# EAGLE design buckler (EAGLE 9.6.2)
AUTHOR: Branden Ghena; REV: C; TITLE: Berkeley Buckler

## Sheet 1 of 3: Headers
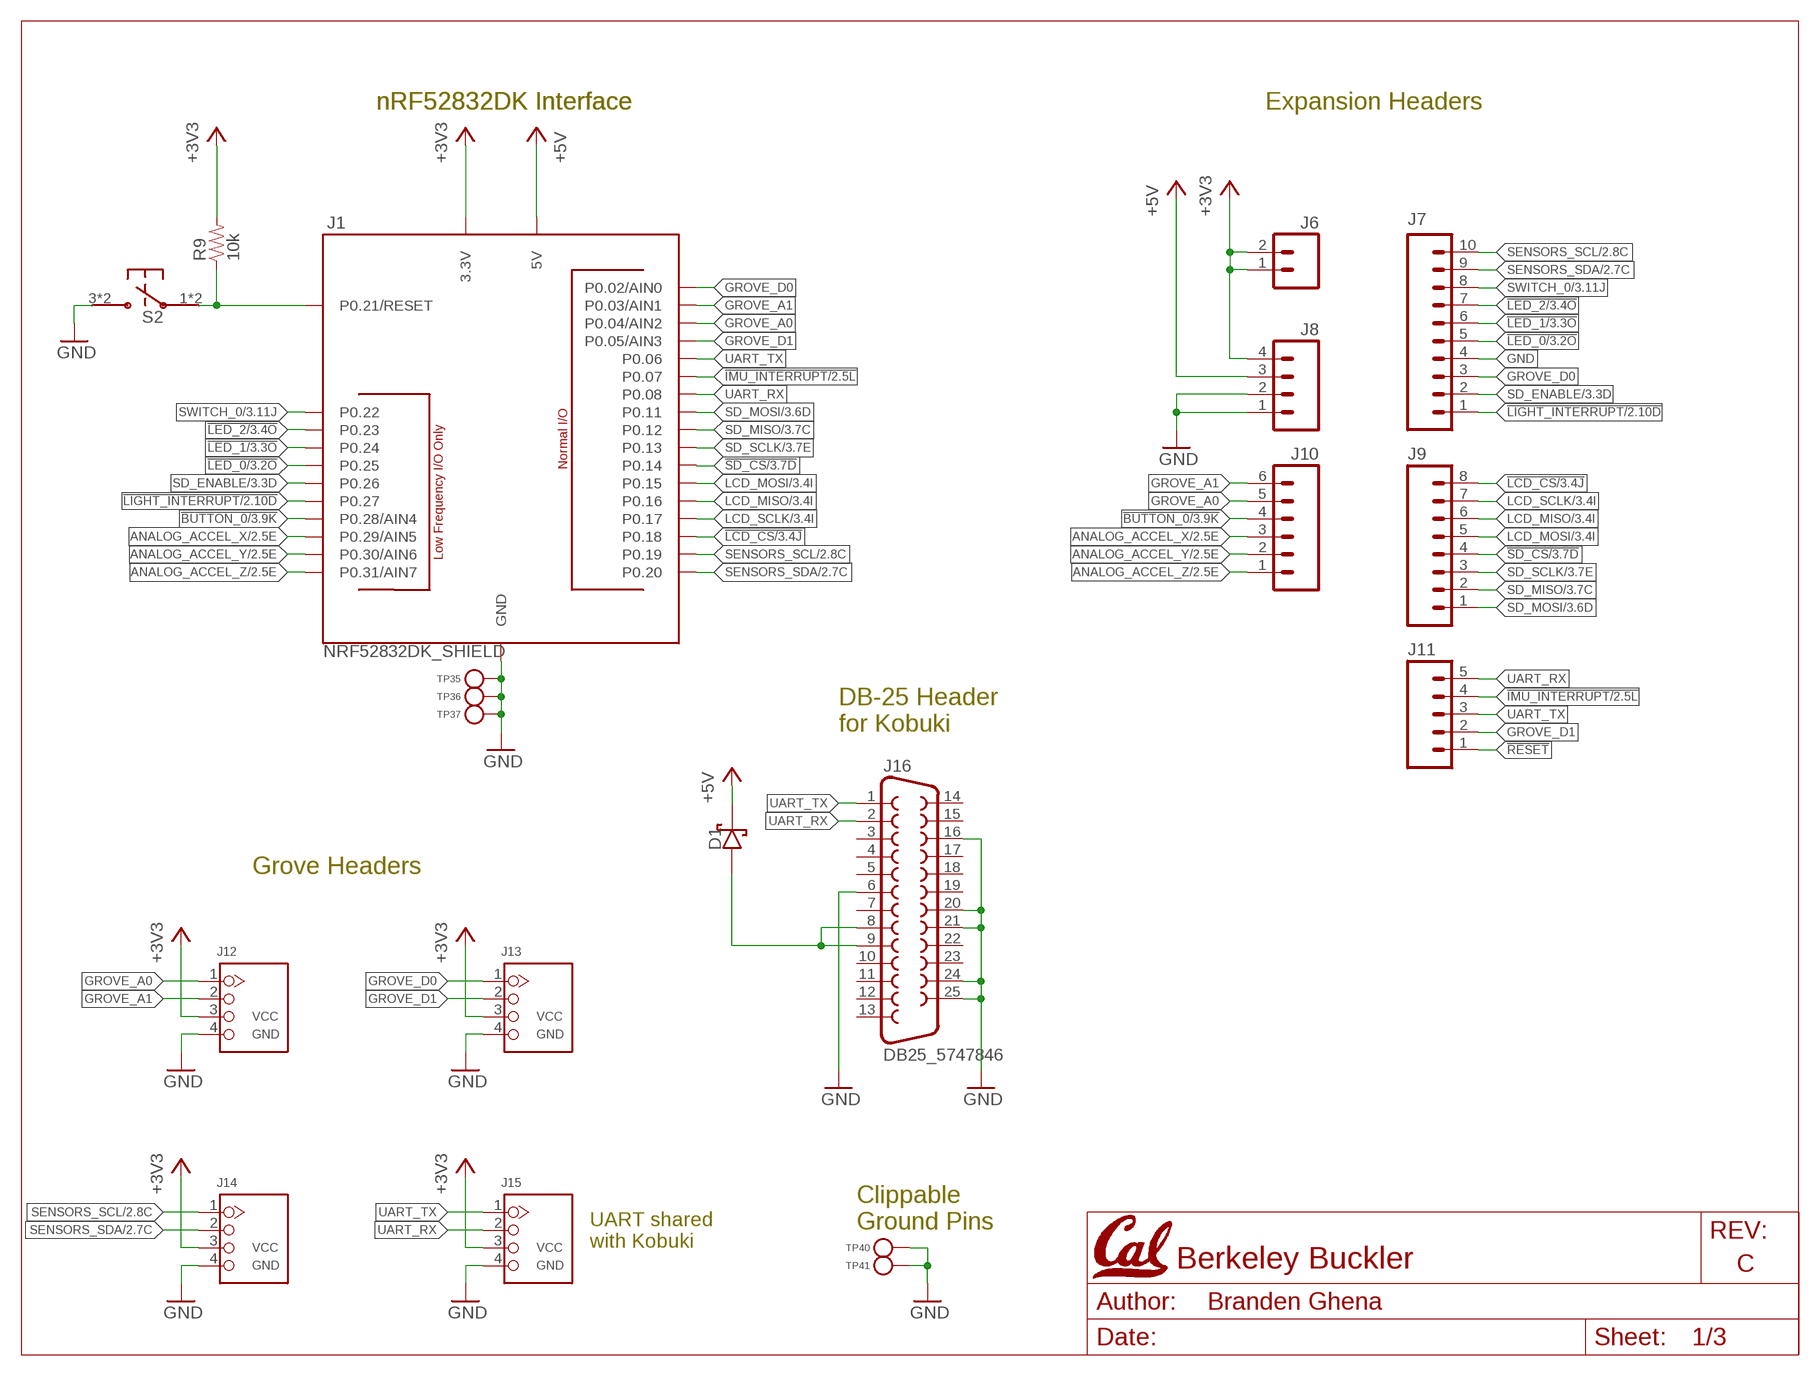
[diagram p0: schematic, sheet 1]
U$1 (LETTER_L_CAL): HEIGHT: 8.5in; WIDTH: 11in

### Parts
D1  DIODE_SCHOTTKYSOD323  [SOD323]
J1  NRF52832DK_SHIELD  [NRF52832DK_SHIELD]
J6  M02PTH  [1X02]
J7  M10"  [1X10]
J8  M04PTH  [1X04]
J9  M081X08  [1X08]
J10  M06SIP  [1X06]
J11  M05PTH  [1X05]
J12  GROVE-CONNECTOR-DIP(4P-2.0)  [HW4-2.0]
J13  GROVE-CONNECTOR-DIP(4P-2.0)  [HW4-2.0]
J14  GROVE-CONNECTOR-DIP(4P-2.0)  [HW4-2.0]
J15  GROVE-CONNECTOR-DIP(4P-2.0)  [HW4-2.0]
J16  DB25_5747846  [DB25_5747846]
R9  10k  RESISTOR0402_RES  [0402_RES]
S2  PTS645SM43SMTR92  [PTS645]
TP35  TEST_POINT_0.040IN  [TESTPOINT_0.040IN]
TP36  TEST_POINT_0.040IN  [TESTPOINT_0.040IN]
TP37  TEST_POINT_0.040IN  [TESTPOINT_0.040IN]
TP40  TEST_POINT_0.078IN  [TESTPOINT_0.078IN]
TP41  TEST_POINT_0.078IN  [TESTPOINT_0.078IN]

### Nets
5V_IN: D1.P$2(ANODE) J16.8 J16.9
!BUTTON_0: J1.P0.28(P0.28/AIN4) J10.4 ; also sheet 3
!IMU_INTERRUPT: J1.P0.07 J11.4 ; also sheet 2
!LCD_CS: J1.P0.18 J9.8 ; also sheet 3
!LED_0: J1.P0.25 J7.5 ; also sheet 3
!LED_1: J1.P0.24 J7.6 ; also sheet 3
!LED_2: J1.P0.23 J7.7 ; also sheet 3
!LIGHT_INTERRUPT: J1.P0.27 J7.1 ; also sheet 2
!RESET: J1.P0.21(P0.21/RESET) J11.1 R9.1 S2.1 S2.2
!SD_CS: J1.P0.14 J9.4 ; also sheet 3
+3V3: J1.3.3V@0(3.3V) J1.3.3V@1(3.3V) J1.3.3V@2(3.3V) J6.1 J6.2 J8.4 J12.3 J13.3 J14.3 J15.3 R9.2 ; also sheet 2,3
+5V: D1.P$1(CATHODE) J1.5V J8.3
ANALOG_ACCEL_X: J1.P0.29(P0.29/AIN5) J10.3 ; also sheet 2
ANALOG_ACCEL_Y: J1.P0.30(P0.30/AIN6) J10.2 ; also sheet 2
ANALOG_ACCEL_Z: J1.P0.31(P0.31/AIN7) J10.1 ; also sheet 2
GND: J1.GND@0(GND) J1.GND@1(GND) J1.GND@2(GND) J7.4 J8.1 J8.2 J12.4 J13.4 J14.4 J15.4 J16.6 J16.16 J16.20 J16.21 J16.24 J16.25 S2.3 S2.4 TP35.TESTPOINT TP36.TESTPOINT TP37.TESTPOINT TP40.1(TESTPOINT) TP41.1(TESTPOINT) ; also sheet 2,3
GROVE_A0: J1.P0.04(P0.04/AIN2) J10.5 J12.1
GROVE_A1: J1.P0.03(P0.03/AIN1) J10.6 J12.2
GROVE_D0: J1.P0.02(P0.02/AIN0) J7.3 J13.1
GROVE_D1: J1.P0.05(P0.05/AIN3) J11.2 J13.2
LCD_MISO: J1.P0.16 J9.6 ; also sheet 3
LCD_MOSI: J1.P0.15 J9.5 ; also sheet 3
LCD_SCLK: J1.P0.17 J9.7 ; also sheet 3
SD_ENABLE: J1.P0.26 J7.2 ; also sheet 3
SD_MISO: J1.P0.12 J9.2 ; also sheet 3
SD_MOSI: J1.P0.11 J9.1 ; also sheet 3
SD_SCLK: J1.P0.13 J9.3 ; also sheet 3
SENSORS_SCL: J1.P0.19 J7.10 J14.1 ; also sheet 2
SENSORS_SDA: J1.P0.20 J7.9 J14.2 ; also sheet 2
SWITCH_0: J1.P0.22 J7.8 ; also sheet 3
UART_RX: J1.P0.08 J11.5 J15.2 J16.2
UART_TX: J1.P0.06 J11.3 J15.1 J16.1
Unconnected: J16.3 J16.4 J16.5 J16.7 J16.10 J16.11 J16.12 J16.13 J16.14 J16.15 J16.17 J16.18 J16.19 J16.22 J16.23

### Notes on the sheet
- nRF52832DK Interface | nRF52832DK Interface | Expansion Headers
- DB-25 Header
  for Kobuki
- Grove Headers
- Clippable
  Ground Pins
- UART shared
  with Kobuki

## Sheet 2 of 3: Sensors
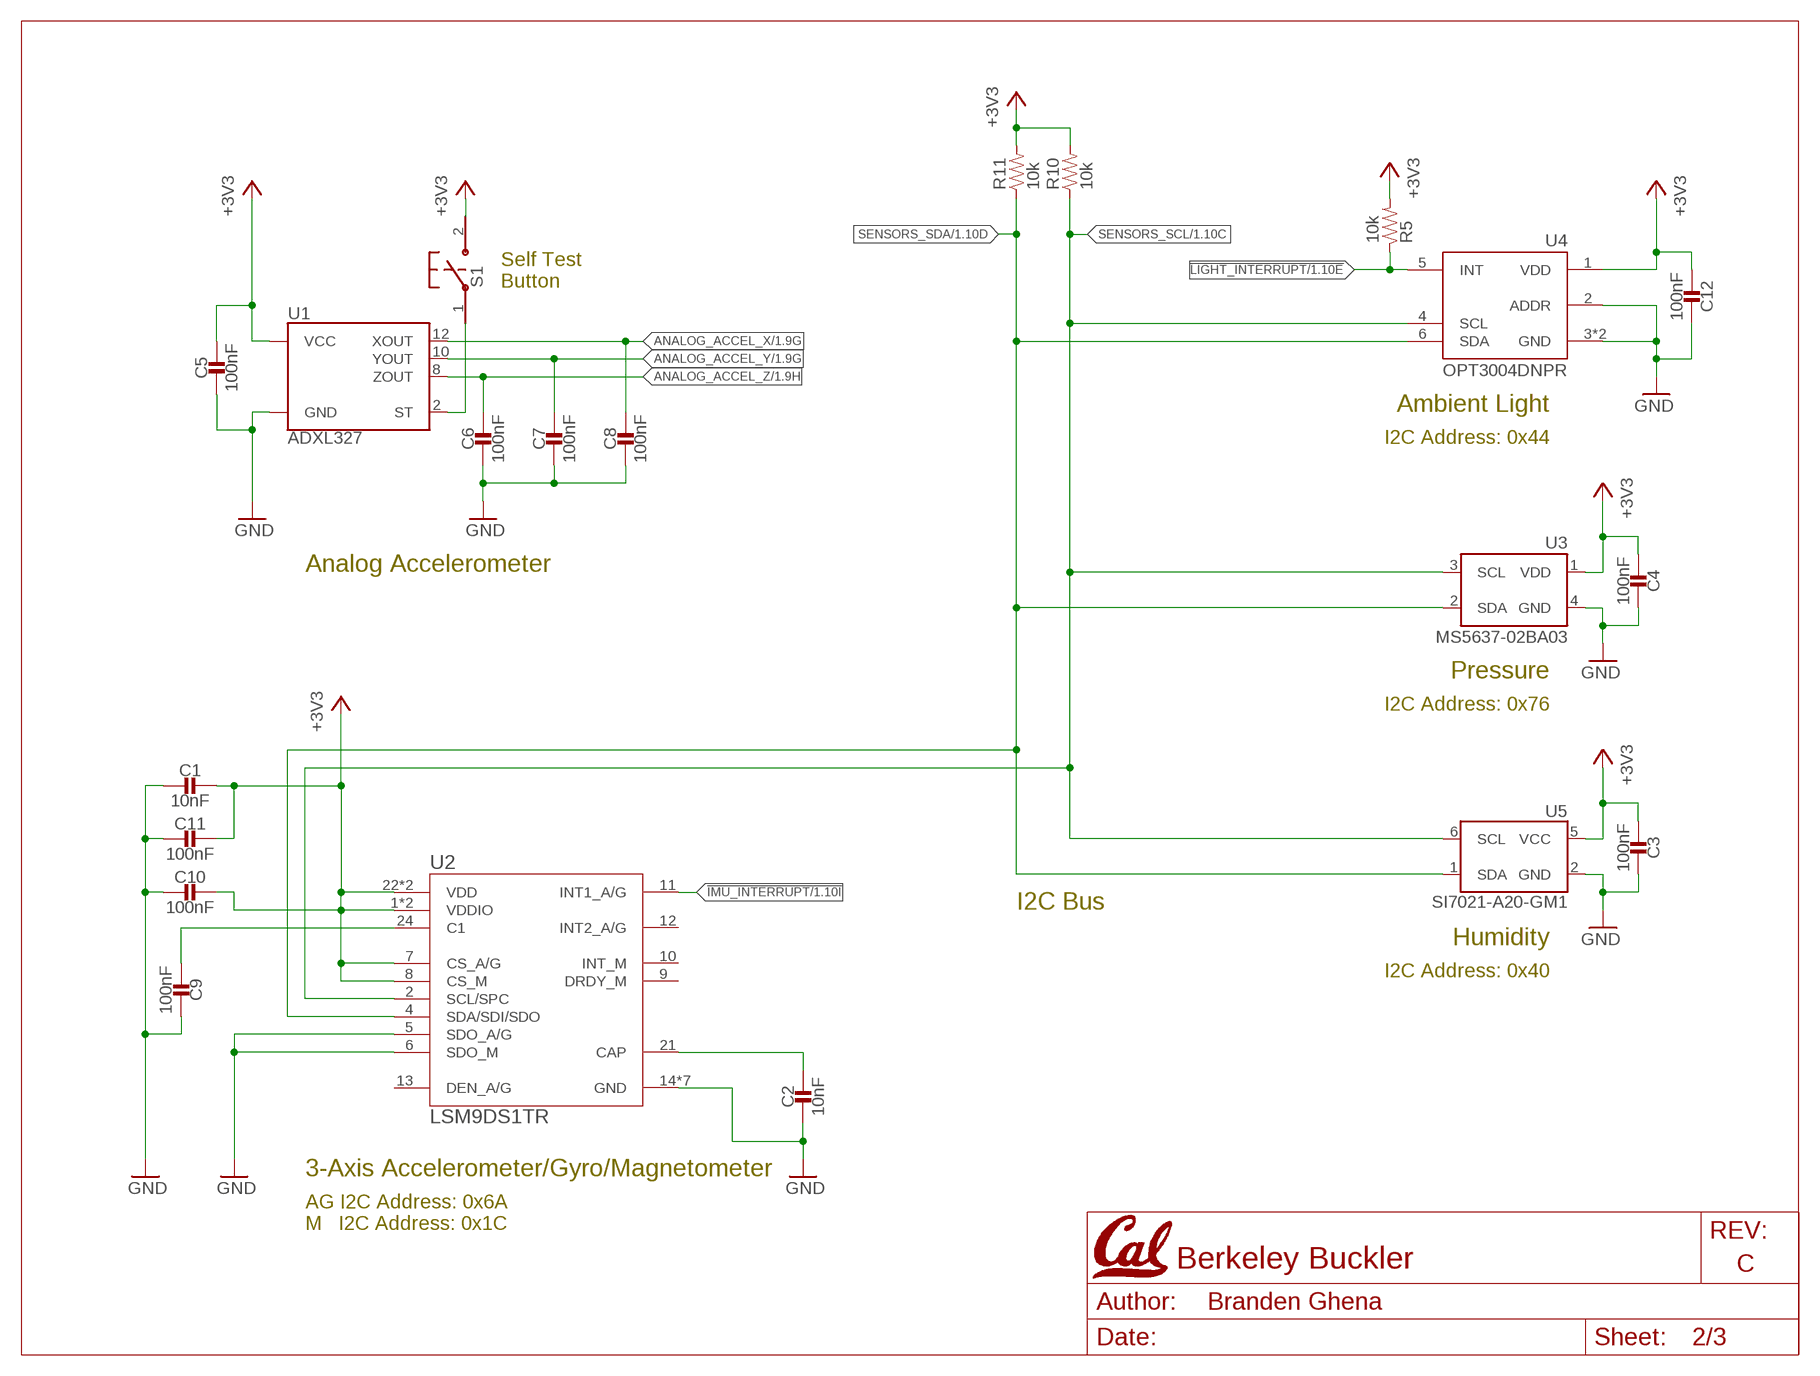
[diagram p1: schematic, sheet 2]
U$2 (LETTER_L_CAL): HEIGHT: 8.5in; WIDTH: 11in

### Parts
C1  10nF  CAPACITOR0402_CAP  [0402_CAP]
C2  10nF  CAPACITOR0402_CAP  [0402_CAP]
C3  100nF  CAPACITOR0402_CAP  [0402_CAP]
C4  100nF  CAPACITOR0402_CAP  [0402_CAP]
C5  100nF  CAPACITOR0402_CAP  [0402_CAP]
C6  100nF  CAPACITOR0402_CAP  [0402_CAP]
C7  100nF  CAPACITOR0402_CAP  [0402_CAP]
C8  100nF  CAPACITOR0402_CAP  [0402_CAP]
C9  100nF  CAPACITOR0402_CAP  [0402_CAP]
C10  100nF  CAPACITOR0402_CAP  [0402_CAP]
C11  100nF  CAPACITOR0402_CAP  [0402_CAP]
C12  100nF  CAPACITOR0402_CAP  [0402_CAP]
R5  10k  RESISTOR0402_RES  [0402_RES]
R10  10k  RESISTOR0402_RES  [0402_RES]
R11  10k  RESISTOR0402_RES  [0402_RES]
S1  B3U-1000P  [B3U-1000P]
U1  ADXL327  [LFCSP-16]
U2  LSM9DS1TR  [LGA-24_3X3P5X1_STM]
U3  MS5637-02BA03  [4-SMD]
U4  OPT3004DNPR  [DNP0006A]
U5  SI7021-A20-GM1  [DFN-6/3MM]

### Nets
!IMU_INTERRUPT: U2.11(INT1_A/G) ; also sheet 1
!LIGHT_INTERRUPT: R5.1 U4.5(INT) ; also sheet 1
+3V3: C1.2 C3.1 C4.1 C5.1 C10.2 C11.2 C12.1 R5.2 R10.2 R11.2 S1.2 U1.14(VCC) U1.15(VCC) U2.1(VDDIO) U2.3(VDDIO) U2.7(CS_A/G) U2.8(CS_M) U2.22(VDD) U2.23(VDD) U3.1(VDD) U4.1(VDD) U5.5(VCC) ; also sheet 1,3
ANALOG_ACCEL_X: C8.1 U1.12(XOUT) ; also sheet 1
ANALOG_ACCEL_Y: C7.1 U1.10(YOUT) ; also sheet 1
ANALOG_ACCEL_Z: C6.1 U1.8(ZOUT) ; also sheet 1
GND: C1.1 C2.1 C3.2 C4.2 C5.2 C6.2 C7.2 C8.2 C9.2 C10.1 C11.1 C12.2 U1.3(GND) U1.5(GND) U1.6(GND) U1.7(GND) U2.5(SDO_A/G) U2.6(SDO_M) U2.14(GND) U2.15(GND) U2.16(GND) U2.17(GND) U2.18(GND) U2.19(GND) U2.20(GND) U3.4(GND) U4.2(ADDR) U4.3(GND) U4.7(GND) U5.2(GND) ; also sheet 1,3
N$1: C9.1 U2.24(C1)
N$6: C2.2 U2.21(CAP)
N$7: S1.1 U1.2(ST)
SENSORS_SCL: R10.1 U2.2(SCL/SPC) U3.3(SCL) U4.4(SCL) U5.6(SCL) ; also sheet 1
SENSORS_SDA: R11.1 U2.4(SDA/SDI/SDO) U3.2(SDA) U4.6(SDA) U5.1(SDA) ; also sheet 1
Unconnected: U2.9(DRDY_M) U2.10(INT_M) U2.12(INT2_A/G) U2.13(DEN_A/G)

### Notes on the sheet
- Self Test
  Button
- Ambient Light
- I2C Address: 0x44
- Analog Accelerometer
- Pressure
- I2C Address: 0x76
- I2C Bus
- Humidity
- I2C Address: 0x40
- 3-Axis Accelerometer/Gyro/Magnetometer
- AG I2C Address: 0x6A
  M   I2C Address: 0x1C

## Sheet 3 of 3: Other Peripherals
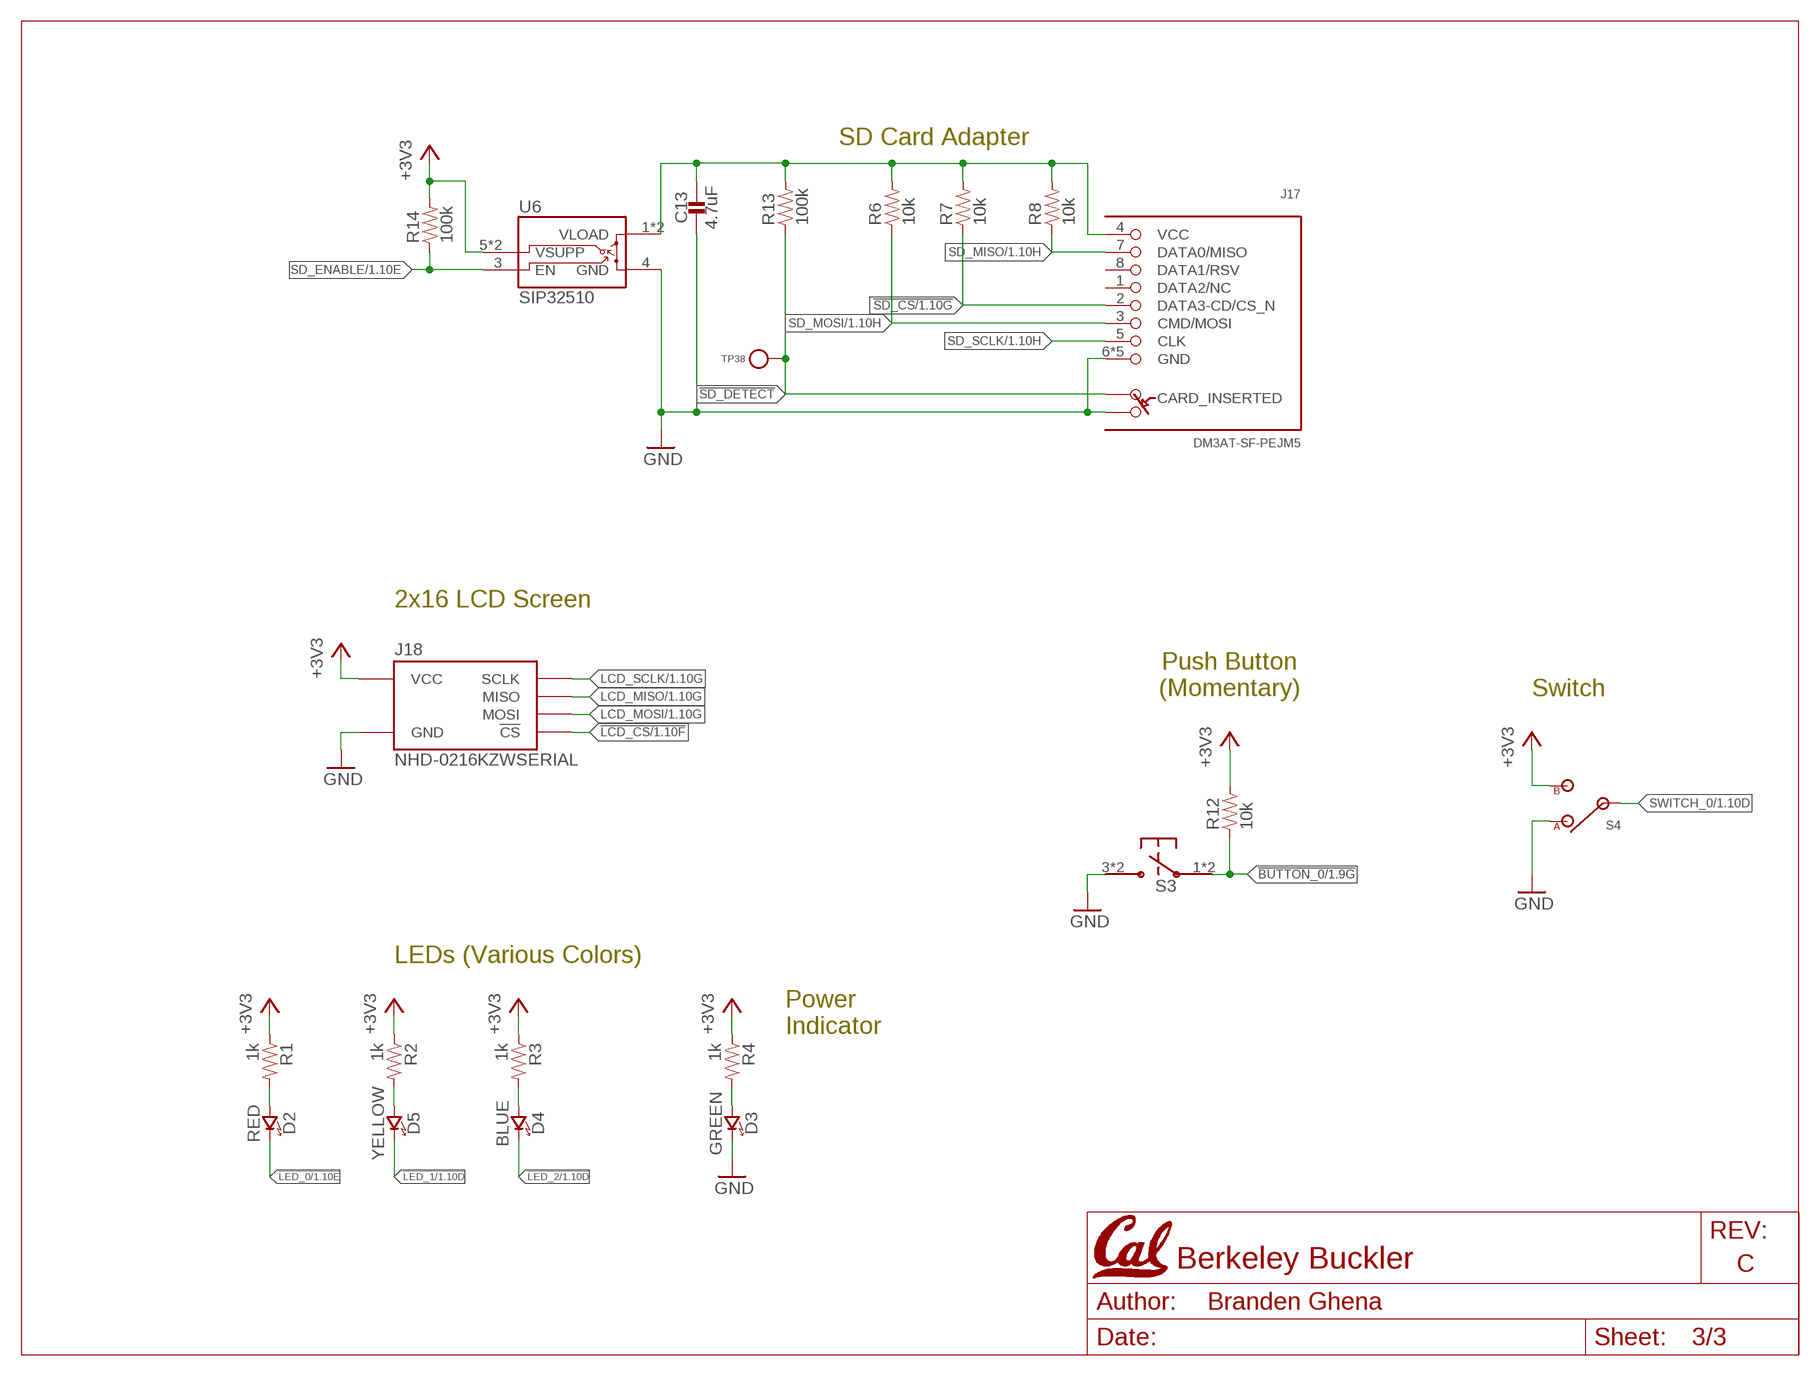
[diagram p2: schematic, sheet 3]
U$3 (LETTER_L_CAL): HEIGHT: 8.5in; WIDTH: 11in

### Parts
C13  4.7uF  CAPACITOR0402_CAP  [0402_CAP]
D2  RED  LED0603  [LED-0603]
D3  GREEN  LED0603  [LED-0603]
D4  BLUE  LED0603  [LED-0603]
D5  YELLOW  LED0603  [LED-0603]
J17  DM3AT-SF-PEJM5  [DM3AT-SF-PEJM5]
J18  NHD-0216KZWSERIAL  [NHD-0216KZW]
R1  1k  RESISTOR0402_RES  [0402_RES]
R2  1k  RESISTOR0402_RES  [0402_RES]
R3  1k  RESISTOR0402_RES  [0402_RES]
R4  1k  RESISTOR0402_RES  [0402_RES]
R6  10k  RESISTOR0402_RES  [0402_RES]
R7  10k  RESISTOR0402_RES  [0402_RES]
R8  10k  RESISTOR0402_RES  [0402_RES]
R12  10k  RESISTOR0402_RES  [0402_RES]
R13  100k  RESISTOR0402_RES  [0402_RES]
R14  100k  RESISTOR0402_RES  [0402_RES]
S3  PTS645SM43SMTR92  [PTS645]
S4  TE_SSA12/SPDT  [TE_SSA12/SPDT]
TP38  TEST_POINT_0.040IN  [TESTPOINT_0.040IN]
U6  SIP32510  [TSOT23-6]

### Nets
!BUTTON_0: R12.1 S3.1 S3.2 ; also sheet 1
!LCD_CS: J18.16(!CS) ; also sheet 1
!LED_0: D2.C(CATHODE) ; also sheet 1
!LED_1: D5.C(CATHODE) ; also sheet 1
!LED_2: D4.C(CATHODE) ; also sheet 1
!SD_CS: J17.2(DATA3-CD/CS_N) R7.1 ; also sheet 1
!SD_DETECT: J17.A R13.1 TP38.TESTPOINT
+3V3: J18.2(VCC) R1.1 R2.1 R3.1 R4.1 R12.2 R14.2 S4.2(B) U6.5(VSUPP) U6.6(VSUPP) ; also sheet 1,2
GND: C13.2 D3.C(CATHODE) J17.6(GND) J17.B J17.MOUNT0(GND) J17.MOUNT1(GND) J17.MOUNT2(GND) J17.MOUNT3(GND) J18.1(GND) S3.3 S3.4 S4.1(A) U6.4(GND) ; also sheet 1,2
LCD_MISO: J18.13(MISO) ; also sheet 1
LCD_MOSI: J18.14(MOSI) ; also sheet 1
LCD_SCLK: J18.12(SCLK) ; also sheet 1
N$3: D3.A(ANODE) R4.2
N$4: D4.A(ANODE) R3.2
N$5: D5.A(ANODE) R2.2
N$18: C13.1 J17.4(VCC) R6.2 R7.2 R8.2 R13.2 U6.1(VLOAD) U6.2(VLOAD)
N$25: D2.A(ANODE) R1.2
SD_ENABLE: R14.1 U6.3(EN) ; also sheet 1
SD_MISO: J17.7(DATA0/MISO) R8.1 ; also sheet 1
SD_MOSI: J17.3(CMD/MOSI) R6.1 ; also sheet 1
SD_SCLK: J17.5(CLK) ; also sheet 1
SWITCH_0: S4.IN ; also sheet 1
Unconnected: J17.1(DATA2/NC) J17.8(DATA1/RSV)

### Notes on the sheet
- SD Card Adapter
- 2x16 LCD Screen
- Push Button
  (Momentary)
- Switch
- LEDs (Various Colors)
- Power
  Indicator

## Library data of the parts
C1 C2 = passives:CAPACITOR: SMD Capacitor; DESCRIPTION: CAP CER 10000PF 25V X7R 0402; DIGIKEY: 399-1279-1-ND; MANUFACTURER: KEMET; MPN: C0402C103J3RACTU
C3-C12 = passives:CAPACITOR: SMD Capacitor; DESCRIPTION: CAP CER 0.1UF 16V X7R 0402; DIGIKEY: 490-4759-1-ND; MANUFACTURER: Murata; MPN: GCM155R71C104KA55D
C13 = passives:CAPACITOR: SMD Capacitor; DESCRIPTION: CAP CER 4.7UF 10V X5R 0402; DIGIKEY: 1276-1480-1-ND; MANUFACTURER: Samsung Electro-Mechanics; MPN: CL05A475KP5NRNC
D1 = passives:DIODE_SCHOTTKY; DESCRIPTION: DIODE SCHOTTKY 30V 500MA SOD323; DIGIKEY: B0530WS-FDICT-ND; MANUFACTURER: Diodes Incorporated; MPN: B0530WS-7-F
D2 = leds:LED: LED; DESCRIPTION: LED RED CLEAR CHIP SMD; DIGIKEY: 160-1436-1-ND; MANUFACTURER: Lite-On Inc.; MPN: LTST-C190KRKT
D3 = leds:LED: LED; DESCRIPTION: LED GREEN CLEAR CHIP SMD; DIGIKEY: 160-1435-1-ND; MANUFACTURER: Lite-On Inc.; MPN: LTST-C190KGKT
D4 = leds:LED: LED; DESCRIPTION: LED BLUE CLEAR SMD; DIGIKEY: 160-1837-1-ND; MANUFACTURER: Lite-On Inc.; MPN: LTST-C194TBKT
D5 = leds:LED: LED; DESCRIPTION: LED YELLOW CLEAR CHIP SMD; DIGIKEY: 160-1437-1-ND; MANUFACTURER: Lite-On Inc.; MPN: LTST-C190KSKT
J1 = headers:NRF52832DK_SHIELD: Shield for the PCA10040 nRF52832 Development Kit; DIGIKEY1: S1011EC-10-ND; DIGIKEY2: S1011EC-08-ND; DIGIKEY3: S1011EC-08-ND; DIGIKEY4: S1011EC-06-ND; DIGIKEY5: S1011EC-09-ND
J6 = SparkFun-Connectors:M02: Header 2 Standard 2-pin 0.1" header. Use with straight break away headers (SKU : PRT-00116), right angle break away headers (PRT-00553), swiss pins (PRT-00743), machine pins (PRT-00117), and female headers (PRT-00115). Molex polarized connector foot print use with SKU : PRT-08233 with associated crimp pins and housings.; DIGIKEY: S1011EC-02-ND
J7 = SparkFun-Connectors:M10: Header 10 Standard 10-pin 0.1" header. Use with straight break away headers (SKU : PRT-00116), right angle break away headers (PRT-00553), swiss pins (PRT-00743), machine pins (PRT-00117), and female headers (PRT-00115).; DIGIKEY: S1011EC-10-ND
J8 = SparkFun-Connectors:M04: Header 4 Standard 4-pin 0.1" header. Use with straight break away headers (SKU : PRT-00116), right angle break away headers (PRT-00553), swiss pins (PRT-00743), machine pins (PRT-00117), and female headers (PRT-00115). Molex polarized connector foot print use with SKU : PRT-08231 with associated crimp pins and housings. 1MM SMD Version SKU: PRT-10208; DIGIKEY: S1011EC-04-ND
J9 = SparkFun-Connectors:M08: Header 8 Standard 8-pin 0.1" header. Use with straight break away headers (SKU : PRT-00116), right angle break away headers (PRT-00553), swiss pins (PRT-00743), machine pins (PRT-00117), and female headers (PRT-00115).; DIGIKEY: S1011EC-08-ND
J10 = SparkFun-Connectors:M06: Header 6 Standard 6-pin 0.1" header. Use with straight break away headers (SKU : PRT-00116), right angle break away headers (PRT-00553), swiss pins (PRT-00743), machine pins (PRT-00117), and female headers (PRT-00115). Molex polarized connector foot print use with SKU : PRT-08094 with associated crimp pins and housings. NOTES ON THE VARIANTS LOCK and LOCK_LONGPADS... This footprint was designed to help hold the alignment of a through-hole component (i.e. 6-pin header) while soldering it into place. You may notice that each hole has been shifted either up or down by 0.005 of an inch from it's more standard position (which is a perfectly straight line). This slight alteration caused the pins (the squares in the middle) to touch the edges of the holes. Because they are alternating, it causes a "brace" to hold the component in place. 0.005 has proven to be the perfect amount of "off-center" position when using our standard breakaway headers. Although looks a little odd when you look at the bare footprint, once you have a header in there, the alteration is very hard to notice. Also, if you push a header all the way into place, it is covered up entirely on the bottom side. This idea of altering the position of holes to aid alignment will be further integrated into the Sparkfun Library for other footprints. It can help hold any component with 3 or more connection pins.; DIGIKEY: S1011EC-06-ND
J11 = SparkFun-Connectors:M05: Header 5 Standard 5-pin 0.1" header. Use with straight break away headers (SKU : PRT-00116), right angle break away headers (PRT-00553), swiss pins (PRT-00743), machine pins (PRT-00117), and female headers (PRT-00115). Molex polarized connector foot print use with SKU : PRT-08230 with associated crimp pins and housings.; DIGIKEY: S1011EC-05-ND
J12-J15 = headers:GROVE-CONNECTOR-DIP(4P-2.0): 320110033; DESCRIPTION: Grove - Universal 4 pin connector; MANUFACTURER: Seeed Studio; MOUSER: 713-110990030; MPN: 110990030; VALUE: 4P-2.0
J16 = headers:DB25_5747846; DESCRIPTION: CONN D-SUB RCPT 25POS R/A SOLDER; DIGIKEY: A32126-ND; MANUFACTURER: TE Connectivity AMP Connectors; MPN: 5747846-4
J17 = connector:DM3AT-SF-PEJM5: CONN MICRO SD R/A PUSH-PUSH SMD; DESCRIPTION: CONN MICRO SD CARD PUSH-PUSH R/A; DIGIKEY: HR1964CT-ND; MANUFACTURER: Hirose Electric Co Ltd; MPN: DM3AT-SF-PEJM5
J18 = headers:NHD-0216KZW; DIGIKEY: NHD-0216KZW-AG5-ND,952-3305-ND; DIGIKEY1: NHD-0216KZW-AG5-ND; DIGIKEY2: 952-3305-ND; DIGIKEY3: 952-1862-ND
R1-R4 = passives:RESISTOR: Resistor Basic schematic elements and footprints for 0201, 0402, 0603, 1206, and PTH resistors.; DESCRIPTION: RES SMD 1K OHM 1% 1/16W 0402; DIGIKEY: RMCF0402FT1K00CT-ND; MANUFACTURER: Stackpole Electronics; MPN: RMCF0402FT1K00
R5-R12 = passives:RESISTOR: Resistor Basic schematic elements and footprints for 0201, 0402, 0603, 1206, and PTH resistors.; DESCRIPTION: RES SMD 10K OHM 1% 1/16W 0402; DIGIKEY: 1276-3431-1-ND; MANUFACTURER: Samsung Electro-Mechanics; MPN: RC1005F103CS
R13 R14 = passives:RESISTOR: Resistor Basic schematic elements and footprints for 0201, 0402, 0603, 1206, and PTH resistors.; DESCRIPTION: RES SMD 100K OHM 1% 1/5W 0402; DIGIKEY: 541-100KYCT-ND; MANUFACTURER: Vishay Dale; MPN: CRCW0402100KFKEDHP
S1 = switches:B3U: Switch; DESCRIPTION: SWITCH TACTILE SPST-NO 0.05A 12V; DIGIKEY: SW1020CT-ND; MANUFACTURER: Omron; MPN: B3U-1000P
S2 S3 = switches:PTS645SM43SMTR92: Tactile Switch SPST-NO Top Actuated Surface Mount; DESCRIPTION: SWITCH TACTILE SPST-NO 0.05A 12V; DIGIKEY: CKN9112CT-ND; MANUFACTURER: C&K; MPN: PTS645SM43SMTR92 LFS
S4 = switches:TE_SSA12/SPDT: SWITCH SLIDE SPDT 2POS SSA SER; DESCRIPTION: SWITCH SLIDE SPDT 100MA 30V; DIGIKEY: 450-1602-ND; MANUFACTURER: TE Connectivity ALCOSWITCH Switches; MPN: SSA12
TP35-TP38 = headers:TEST_POINT_0.040IN: 0.040in Test Point; DIGIKEY: 5001K-ND
TP40 TP41 = headers:TEST_POINT_0.078IN; DESCRIPTION: TERM TURRET SINGLE L=4.75MM TIN; DIGIKEY: 36-1520-2-ND; MANUFACTURER: Keystone Electronics; MPN: 1520-2
U1 = chips:ADXL327: ADXL327 3-Axis Analog Accelerometer; DESCRIPTION: ACCELEROMETER 2G ANALOG 16LFCSP; DIGIKEY: ADXL327BCPZ-ND; MANUFACTURER: Analog Devices Inc.; MPN: ADXL327BCPZ
U2 = chips:LSM9DS1TR; BUILT_BY: EMA_Jessica; COPYRIGHT: Copyright (C) 2018 Accelerated Designs. All rights reserved; MANUFACTURER_PART_NUMBER: LSM9DS1TR; SOURCELIBRARY: STMicro_2020-01-02; VENDOR: STMicroelectronics
U3 = chips:MS5637-02BA03: low power pressure sensor; DESCRIPTION: SENSOR 17.4PSIA I2C 24B 4-QFN; DIGIKEY: 223-1199-1-ND; MANUFACTURER: TE CONNECTIVITY; MPN: MS563702BA03-50
U4 = chips:OPT3004DNPR; MANUFACTURER: Texas Instruments; PARTNUMBER: OPT3004DNPR; REFDES: RefDes
U5 = chips:SI7021: IC TEMP SENSOR RH 2% DFN; DESCRIPTION: SENS HUMI/TEMP 3.6V I2C 3% 6DFN; DIGIKEY: 336-3141-ND; MANUFACTURER: Silicon Labs; MOUSER: 634-SI7021-A20-GM1; MPN: SI7021-A20-GM1
U6 = chips:SIP32510: Load switch, slew rate controlled. By Vishay; DESCRIPTION: IC LOAD SWITCH SOT23-6; DIGIKEY: SIP32510DT-T1-GE3CT-ND; MANUFACTURER: Vishay; MPN: SIP32510DT-T1-GE3

## Board
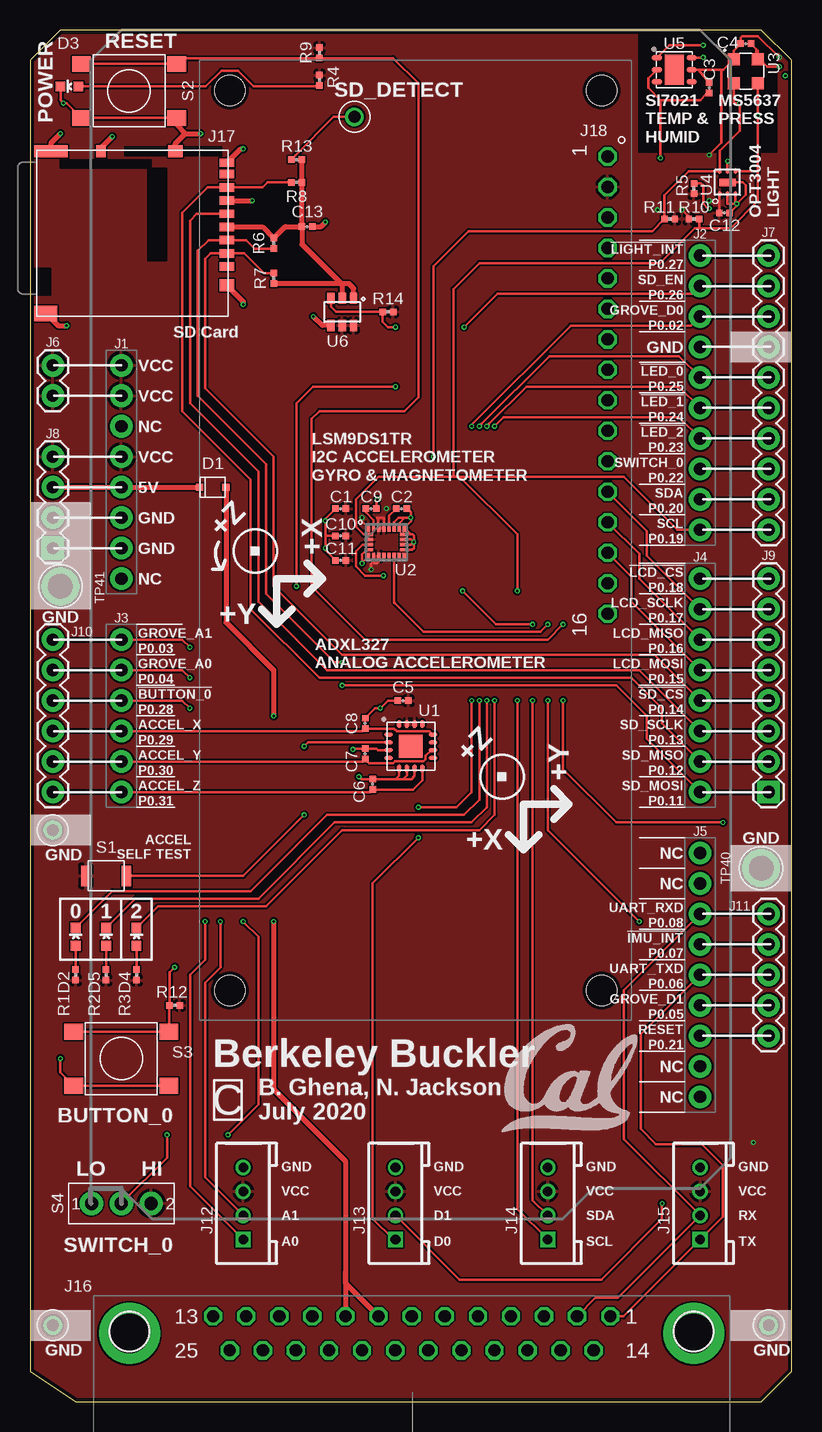
[diagram p3: board, top side]
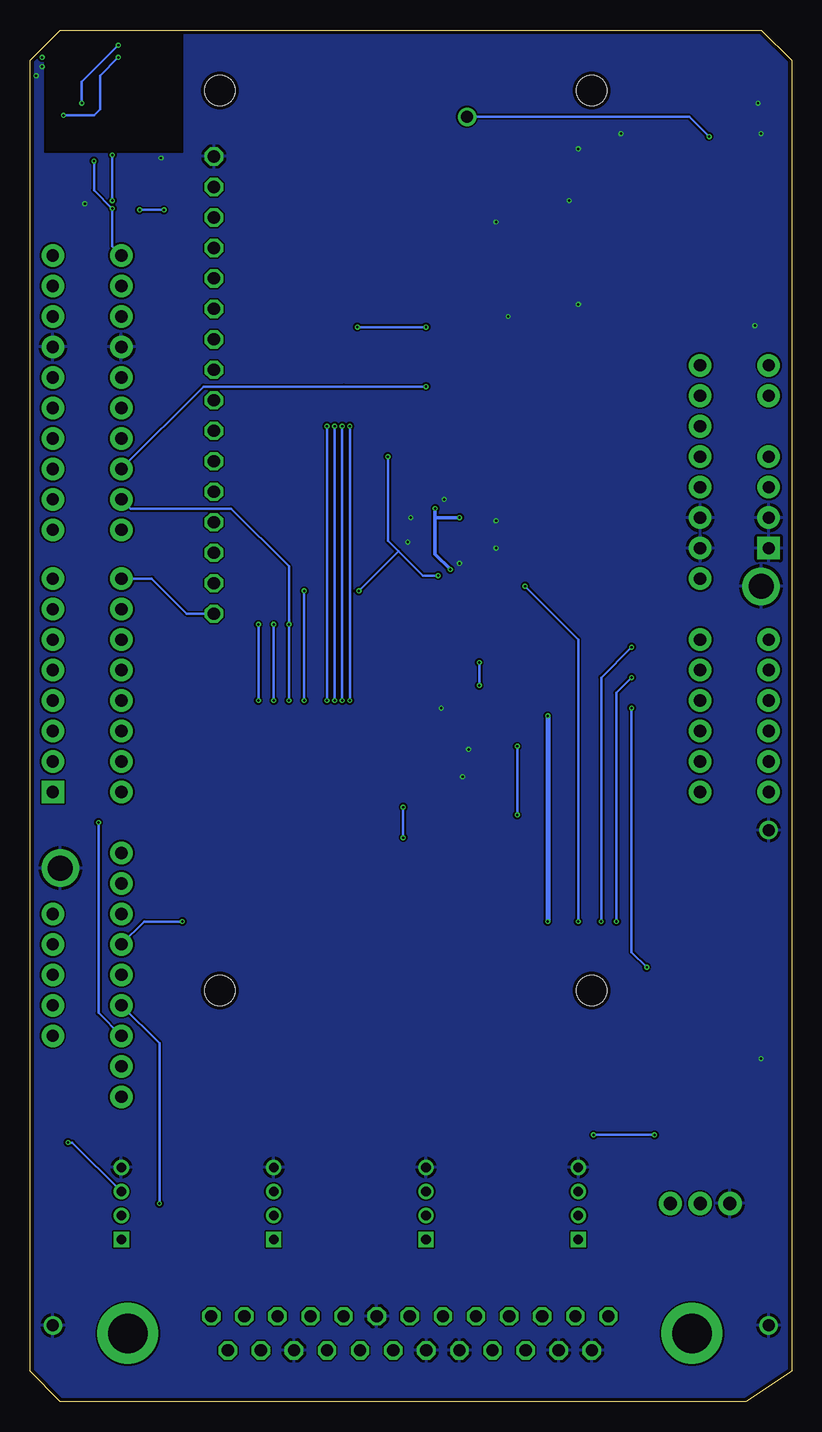
[diagram p4: board, bottom side, seen from below]

Size 63.5 x 114.3 mm. Coordinates in mm from the lower left corner, seen from the top.
Outline: 60.96,114.3 2.54,114.3 0,111.76 0,2.54 3.81,0 60.96,0 63.5,2.54 63.5,111.76 60.96,114.3
Copper layers (1*16): Top 0.0178mm / dielectric 59mil / Bottom 0.0178mm
Design rules "quickturn_co_kr_1oz": minimum track width 4mil, minimum drill 0.200659375mm, track to track 6mil, track to pad 6mil, pad to pad 6mil, via to via 6mil, smd to smd 6mil, copper to edge 12mil, drill to drill 12mil, minimum pad ring 8mil, minimum via ring 4mil, stop-mask expansion 3mil, vias tented up to drill 50mil, thermal gap 10mil

### Footprints (pad centres in the part's own frame; a part is rotated, then mirrored left to right if it is on the bottom)
0402_CAP = smd 0.536 x 0.546: 1 -0.433,0; 2 0.433,0
SOD323 = smd 0.6 x 0.6: P$1 -1.1,0; P$2 1.1,0
LED-0603 = smd 0.8 x 0.8: A 0,-0.75; C 0,0.75
NRF52832DK_SHIELD = drill 1.016 pad 1.88: 3.3V@0 0,-7.62; 3.3V@1 0,-2.54; 3.3V@2 0,0; 5V 0,-10.16; !RESET 0,-5.08; GND@0 0,-12.7; GND@1 0,-15.24; GND@2 48.26,1.524; NC@0 0,-17.78; NC@1 48.26,-58.42; NC@2 48.26,-60.96; P0.02 48.26,4.064; P0.03 0,-22.86; P0.04 0,-25.4; P0.05 48.26,-53.34; P0.06 48.26,-50.8; P0.07 48.26,-48.26; P0.08 48.26,-45.72; P0.09 48.26,-43.18; P0.10 48.26,-40.64; P0.11 48.26,-35.56; P0.12 48.26,-33.02; P0.13 48.26,-30.48; P0.14 48.26,-27.94; P0.15 48.26,-25.4; P0.16 48.26,-22.86; P0.17 48.26,-20.32; P0.18 48.26,-17.78; P0.19 48.26,-13.716; P0.20 48.26,-11.176; P0.21 48.26,-55.88; P0.22 48.26,-8.636; P0.23 48.26,-6.096; P0.24 48.26,-3.556; P0.25 48.26,-1.016; P0.26 48.26,6.604; P0.27 48.26,9.144; P0.28 0,-27.94; P0.29 0,-30.48; P0.30 0,-33.02; P0.31 0,-35.56
1X02 = drill 1.016 pad 1.88: 1 0,0; 2 2.54,0
1X10 = drill 1.016 pad 1.88: 1 0,0; 2 2.54,0; 3 5.08,0; 4 7.62,0; 5 10.16,0; 6 12.7,0; 7 15.24,0; 8 17.78,0; 9 20.32,0; 10 22.86,0
1X04 = drill 1.016 pad 1.88 square: 1 0,0 | drill 1.016 pad 1.88: 2 2.54,0; 3 5.08,0; 4 7.62,0
1X08 = drill 1.016 pad 1.88 square: 1 0,0 | drill 1.016 pad 1.88: 2 2.54,0; 3 5.08,0; 4 7.62,0; 5 10.16,0; 6 12.7,0; 7 15.24,0; 8 17.78,0
1X06 = drill 1.016 pad 1.88: 1 0,0; 2 2.54,0; 3 5.08,0; 4 7.62,0; 5 10.16,0; 6 12.7,0
1X05 = drill 1.016 pad 1.88: 1 0,0; 2 2.54,0; 3 5.08,0; 4 7.62,0; 5 10.16,0
HW4-2.0 = drill 0.8 pad 1.27 square: 1 -3,0 | drill 0.8 pad 1.27: 2 -1,0; 3 1,0; 4 3,0
DB25_5747846 = drill 1.016 octagon: 1 0,0; 2 2.76,0; 3 5.52,0; 4 8.28,0; 5 11.041,0; 6 13.801,0; 7 16.561,0; 8 19.321,0; 9 22.081,0; 10 24.841,0; 11 27.601,0; 12 30.362,0; 13 33.122,0; 14 1.379,2.845; 15 4.139,2.845; 16 6.898,2.845; 17 9.657,2.845; 18 12.417,2.845; 19 15.176,2.845; 20 17.935,2.845; 21 20.695,2.845; 22 23.454,2.845; 23 26.213,2.845; 24 28.973,2.845; 25 31.732,2.845 | drill 3.302 pad 5.08: G1 -6.96,1.422; G2 40.081,1.422
DM3AT-SF-PEJM5 = smd 0.7 x 1.2: 1 3.2,-0.1; 2 2.1,-0.1; 3 1,-0.1; 4 -0.1,-0.1; 5 -1.2,-0.1; 6 -2.3,-0.1; 7 -3.4,-0.1; 8 -4.5,-0.1; B -5.45,-0.1 | smd 1 x 0.8: A -6.4,-10.6 | smd 1 x 1.2: MOUNT0 4.75,-0.1; MOUNT1 -6.4,-4.4 | smd 1 x 2.8: MOUNT2 -6.4,-14.75 | smd 1.3 x 1.9: MOUNT3 7.1,-15.2
NHD-0216KZW = drill 1.016 octagon: 1 8,-2; 2 10.54,-2; 3 13.08,-2; 4 15.62,-2; 5 18.16,-2; 6 20.7,-2; 7 23.24,-2; 8 25.78,-2; 9 28.32,-2; 10 30.86,-2; 11 33.4,-2; 12 35.94,-2; 13 38.48,-2; 14 41.02,-2; 15 43.56,-2; 16 46.1,-2 | hole 2.5: 2.5,-2.5; 2.5,-33.5; 77.5,-33.5; 77.5,-2.5
0402_RES = smd 0.536 x 0.546: 1 -0.433,0; 2 0.433,0
B3U-1000P = smd 0.8 x 1.7: 1 -1.7,0; 2 1.7,0
PTS645 = smd 1.55 x 1.3: 1 -3.975,2.25; 2 3.975,2.25; 3 3.975,-2.25; 4 -3.975,-2.25
TE_SSA12/SPDT = drill 1.092 pad 1.93: 1 -2.489,0; 2 2.489,0; IN 0,0
TESTPOINT_0.040IN = drill 1.016: TESTPOINT 0,0
TESTPOINT_0.078IN = drill 2.083: 1 0,0
LFCSP-16 = smd 0.7 x 0.35: 1 -1.85,0.975; 2 -1.85,0.325; 3 -1.85,-0.325; 4 -1.85,-0.975; 9 1.85,-0.975; 10 1.85,-0.325; 11 1.85,0.325; 12 1.85,0.975 | smd 0.35 x 0.7: 5 -0.975,-1.85; 6 -0.325,-1.85; 7 0.325,-1.85; 8 0.975,-1.85; 13 0.975,1.85; 14 0.325,1.85; 15 -0.325,1.85; 16 -0.975,1.85 | smd 1.95 x 1.95: PAD 0,0
LGA-24_3X3P5X1_STM = smd 0.281 x 0.654: 1 -1.505,1.2; 6 -1.505,-1.2; 7 -1.075,-1.2; 8 -0.645,-1.2; 9 -0.215,-1.2; 10 0.215,-1.2; 11 0.645,-1.2; 12 1.075,-1.2; 13 1.505,-1.2; 18 1.505,1.2; 19 1.075,1.2; 20 0.645,1.2; 21 0.215,1.2; 22 -0.215,1.2; 23 -0.645,1.2; 24 -1.075,1.2 | smd 0.654 x 0.281: 2 -1.45,0.645; 3 -1.45,0.215; 4 -1.45,-0.215; 5 -1.45,-0.645; 14 1.45,-0.645; 15 1.45,-0.215; 16 1.45,0.215; 17 1.45,0.645
4-SMD = smd 1 x 1: 1 -1,1; 2 -1,-1; 3 1,-1; 4 1,1
DNP0006A = smd 0.5 x 0.25: 1 -0.95,0.65; 2 -0.95,0; 3 -0.95,-0.655; 4 0.95,-0.65; 5 0.95,0; 6 0.95,0.65 | smd 0.65 x 1.35: 7 0,0
DFN-6/3MM = smd 0.85 x 0.45: 1 -1.45,1; 2 -1.45,0; 3 -1.45,-1; 4 1.45,-1; 5 1.45,0; 6 1.45,1 | smd 1.6 x 2.5: P$1 0,0
TSOT23-6 = smd 0.6 x 0.927: 1 -0.95,-1.126; 2 0,-1.126; 3 0.95,-1.126; 4 0.95,1.126; 5 0,1.126; 6 -0.95,1.126

### Placement (x,y rotation side)
C1  25.91,74.42 0 top
C2  30.99,74.42 180 top
C3  56.64,109.47 270 top
C4  59.69,113.16 0 top
C5  31.11,58.42 180 top
C6  28.57,51.44 90 top
C7  27.94,53.98 90 top
C8  27.94,56.52 90 top
C9  28.45,74.42 0 top
C10  25.91,72.14 0 top
C11  25.91,70.1 0 top
C12  57.91,99.06 0 top
C13  23.11,97.92 0 top
D1  15.24,76.2 0 top
D2  3.81,38.73 0 top
D3  3.3,109.6 90 top
D4  8.89,38.73 0 top
D5  6.35,38.73 0 top
J1  7.62,86.36 0 top
J6  1.91,83.82 90 top
J7  61.59,95.5 270 top
J8  1.91,71.12 90 top
J9  61.59,50.8 90 top
J10  1.91,50.8 90 top
J11  61.59,30.48 90 top
J12  17.78,16.51 90 top
J13  30.48,16.51 90 top
J14  43.18,16.51 90 top
J15  55.88,16.51 90 top
J16  48.39,7.11 180 top
J17  16.51,97.79 270 top
J18  50.16,111.76 270 top
R1  3.81,35.56 90 top
R2  6.35,35.56 90 top
R3  8.89,35.56 90 top
R4  24.13,110.11 270 top
R5  55.37,101.09 270 top
R6  20.32,96.52 90 top
R7  20.32,93.6 270 top
R8  22.23,101.6 0 top
R9  24.13,112.39 90 top
R10  55.37,98.55 180 top
R11  53.34,98.55 0 top
R12  12.06,33.02 0 top
R13  22.23,103.5 0 top
R14  29.84,90.8 0 top
S1  6.35,43.82 180 top
S2  8.26,109.22 0 top
S3  7.62,28.58 0 top
S4  7.62,16.51 0 top
TP35  61.59,6.35 0 top
TP36  1.91,6.35 0 top
TP37  1.91,47.62 0 top
TP38  27.05,107.06 0 top
TP40  60.96,44.45 0 top
TP41  2.54,67.94 0 top
U1  31.75,54.61 0 top
U2  29.72,71.63 0 top
U3  59.69,110.87 0 top
U4  58.17,101.6 90 top
U5  53.72,111 0 top
U6  26.04,90.8 180 top
U$5  [UCB_CAL_350MIL]  39.37,22.48 0 top

### Tracks (layer width: path | path; a pad name or v marks a point on that pad's centre or on a via)
5V_IN  (via drill 0.2)
  Top 0.406: D1.P$2 16.34,64.94 20.32,60.96 v20.32,57.15 | v20.32,40.01 20.32,26.03 26.31,20.05 26.31,10.79 | 26.31,10.79 J16.9 | J16.8 26.31,9.87 26.31,10.79
  Bottom 0.406: v20.32,57.15 v20.32,40.01
!BUTTON_0  (via drill 0.2)
  Top 0.203: J10.4 J1.P0.28 12.7,58.42 v13.34,57.79 | S3.1 S3.2 11.6,32.98 R12.1 11.63,35.76 v12.06,36.2
  Bottom 0.203: v13.34,57.79 13.34,37.46 v12.06,36.2
!IMU_INTERRUPT  (via drill 0.2)
  Top 0.203: J1.P0.07 J11.4 | v50.8,40.01 43.18,47.62 v43.18,58.42 | v43.18,64.77 42.55,64.13 32.82,64.13 30.44,66.51 30.36,66.59 U2.11
  Bottom 0.203: J1.P0.07 53.98,40.01 v50.8,40.01 | v43.18,58.42 v43.18,64.77
!LCD_CS
  Top 0.203: J9.8 J1.P0.18
  Bottom 0.203: J1.P0.18 53.34,68.58 50.42,65.66 J18.16
!LED_0  (via drill 0.2)
  Top 0.203: J7.5 J1.P0.25 54.1,87.12 43.3,87.12 37.64,81.47 37.64,81.46 v37.47,81.28 | D2.C 6.87,42.55 18.41,42.55 24.77,48.9 36.2,48.9 37.47,50.16 v37.47,58.42
  Bottom 0.203: v37.47,81.28 v37.47,58.42
!LED_1  (via drill 0.2)
  Top 0.203: J7.6 J1.P0.24 54.1,84.58 41.39,84.58 38.28,81.47 38.28,81.46 v38.1,81.28 | D5.C 8.78,41.91 19.05,41.91 25.4,48.26 36.83,48.26 38.1,49.53 v38.1,58.42
  Bottom 0.203: v38.1,81.28 v38.1,58.42
!LED_2  (via drill 0.2)
  Top 0.203: J7.7 J1.P0.23 54.1,82.04 39.5,82.04 v38.73,81.28 | D4.C 10.68,41.27 19.68,41.27 26.04,47.62 37.47,47.62 38.73,48.9 v38.73,58.42
  Bottom 0.203: v38.73,81.28 v38.73,58.42
!LIGHT_INTERRUPT  (via drill 0.2)
  Top 0.203: J1.P0.27 J7.1 | U4.5 v58.17,103.38 | R5.1 55.95,101.52 56.13,101.35 56.13,99.82 56.53,99.42 v56.64,99.42
  Bottom 0.203: J1.P0.27 56.64,96.27 v56.64,99.42 58.17,100.95 v58.17,103.38
!RESET  (via drill 0.2)
  Top 0.203: J1.P0.21 J11.1 | S2.1 S2.2 12.72,111.96 R9.1 30.28,111.96 32.38,109.85 32.38,83.69 31.24,82.55 24.13,82.55 23.5,81.91 23.5,67.94 27.94,63.5 43.18,63.5 v44.45,64.77 | v44.45,58.42 44.45,52.7 48.9,48.26 v57.78,48.26
  Bottom 0.203: v44.45,64.77 v44.45,58.42 | J1.P0.21 57.78,32.38 v57.78,48.26
!SD_CS
  Top 0.203: J9.4 J1.P0.14 52.07,62.23 26.04,62.23 20.32,67.94 20.32,78.74 14.61,84.45 14.61,95.25 15.04,95.69 J17.2 17.85,95.69 19.51,94.03 R7.1
!SD_DETECT  (via drill 0.2)
  Top 0.203: J17.A 5.91,104.46 | R13.1 22.14,103.85 22.14,103.88 25.31,107.06 TP38.TESTPOINT
  Top 0.406: 5.91,104.46 v6.86,105.41
  Bottom 0.203: v6.86,105.41 8.51,107.06 TP38.TESTPOINT
+3V3  (via drill 0.2)
  Top 0.203: v62.48,112.01 60.71,113.79 59.38,113.79 59.26,113.66 C4.1 58.69,112.59 U3.1 57.82,111 57.66,111 | 57.66,111 U5.5 55.71,111 C3.1 | 57.66,111 57.66,104.9 v56.64,103.89 | R10.2 54.94,98.73 v54.36,99.31 | U2.8 29.07,69.97 28.96,69.85 28.7,69.85 28.7,70.37 U2.7 28.61,70.39 28.61,70 28.45,69.84 v28.45,69.34 | U2.23 29.04,72.86 29.04,73.57 28.96,73.66 29.46,73.66 29.5,73.62 U2.22 | U2.1 27.69,73.35 v27.69,73.66 | C12.1 57.48,100.61 U4.1
  Bottom 0.203: J15.3 59.96,21.59 v60.33,21.59 | v56.64,103.89 v56.64,100.08 | v54.36,99.31 v52.32,99.31
  Bottom 0.305: v28.45,69.34 29.72,70.61 29.72,73.66 | 29.72,73.66 v29.72,74.42 | v27.69,73.66 29.72,73.66
  pour Top: -4.45,113.66 1.27,119.38 68.58,119.38 74.93,113.03 74.93,1.9 70.48,-2.54 -4.45,-2.54 -6.99,0 -6.99,1.27 -6.99,111.12
+5V
  Top 0.406: J8.3 J1.5V D1.P$1
ANALOG_ACCEL_X
  Top 0.203: J10.3 J1.P0.29 27.74,55.88 C8.1 30.37,56.08 30.6,55.86 33.33,55.86 U1.12
ANALOG_ACCEL_Y
  Top 0.203: J10.2 J1.P0.30 27.74,53.34 C7.1 28.28,53.21 30.25,53.21 30.43,53.38 32.83,53.38 33,53.55 33,53.81 33.47,54.29 U1.10
ANALOG_ACCEL_Z
  Top 0.203: J10.1 J1.P0.31 28.37,50.8 C6.1 31.95,51 32.73,51.77 U1.8
GND  (via drill 0.2)
  Top 0.203: S2.3 S2.4 3.05,108.2 v2.79,108.2 2.55,108.45 D3.C | S3.3 S3.4 2.54,27.43 v2.54,28.58 | U5.2 51.56,110.29 51.56,109.47 52.58,108.46 | 52.58,108.46 v52.58,103.63 | U3.4 60.69,112.59 C4.2 60.58,112.7 60.58,112.14 61.47,111.25 v62.48,111.25 | U1.7 32.08,52.14 31.8,51.87 31.11,51.87 | 30.48,51.87 31.11,51.87 | U1.6 31.43,52.18 31.11,51.87 | U1.5 30.77,52.16 30.48,51.87 | v27.43,52.07 27.63,51.87 C6.2 30.48,51.87 | C8.2 28.78,57.79 v29.21,57.79 29.84,58.42 C5.2 | U1.3 29.03,54.29 28.9,54.41 C7.2 26.98,54.41 v26.92,54.36 | C3.2 56.57,108.97 56.39,108.97 55.88,108.46 52.58,108.46 | U2.5 28.06,70.98 27.69,70.61 v27.69,69.85 27.69,69.9 U2.6 | U2.17 31.87,72.27 31.88,72.26 | 31.88,72.26 32,72.14 v32,71.63 | U2.14 31.87,70.98 32,71.12 v32,71.63 | U2.15 31.79,71.41 v32,71.63 | U2.16 31.79,71.84 v32,71.63 | 31.88,72.26 31.79,72.26 U2.18 31.75,73.35 v31.75,73.66 | C2.1 31.75,74.09 v31.75,73.66 | U2.20 30.36,73.29 30.73,73.66 31.24,73.66 | 31.24,73.66 v31.75,73.66 | U2.19 30.79,73.21 31.24,73.66 | C9.2 28.88,75.11 v28.96,75.18 | C11.1 24.64,70.94 v24.64,71.12 24.64,72.14 | 24.64,72.14 v24.64,73.41 24.64,73.58 C1.1 | C10.1 24.64,72.14 | U4.7 59.44,101.6 59.69,101.35 59.69,100.58 v58.93,99.82 | v58.93,99.82 58.82,99.93 U4.3 | U4.2 58.17,99.82 v58.93,99.82 | C12.2 58.93,99.64 v58.93,99.82
  Top 0.406: J17.MOUNT2 1.76,104.88 v2.54,105.66 | J17.MOUNT3 2.34,89.66 v3.05,89.66 | J17.B 17.56,104.39 v17.78,104.39 | J17.6 16.42,100.08 v18.54,100.08 | J17.MOUNT0 17.78,91.67 v17.78,91.44 | U6.4 24.37,89.68 v23.62,90.42 | C13.2 24.26,97.92 v24.64,98.3 | J17.MOUNT1 12.11,104.82 12.95,105.66 | 12.95,105.66 v14.22,105.66 | S2.3 12.23,106.39 12.95,105.66
  other vias: 62.99,110.49
  pour Bottom: -5.08,116.84 63.5,116.84 67.31,113.03 67.31,3.81 62.23,-1.27 0,-1.27 -7.62,6.35 -7.62,114.3
GROVE_A0  (via drill 0.2)
  Top 0.203: J10.5 J1.P0.04 12.7,60.96 v13.34,60.33 | v14.61,40.01 14.61,36.83 13.34,35.56 13.34,17.95 J12.1
  Bottom 0.203: v13.34,60.33 14.61,59.05 v14.61,40.01
GROVE_A1  (via drill 0.2)
  Top 0.203: J10.6 J1.P0.03 12.7,63.5 v13.34,62.87 | v15.88,40.01 15.88,36.2 14.61,34.92 14.61,18.69 J12.2
  Bottom 0.203: v13.34,62.87 15.88,60.33 v15.88,40.01
GROVE_D0  (via drill 0.2)
  Top 0.203: J7.3 J1.P0.02 55.12,89.66 45.09,89.66 36.83,81.41 v36.83,81.28 | v36.83,58.42 36.83,50.8 35.56,49.53 v32.38,49.53 | v32.38,46.99 28.57,43.18 28.57,15.24 30.3,13.51 J13.1
  Bottom 0.203: v32.38,49.53 v32.38,46.99 | v36.83,81.28 v36.83,58.42
GROVE_D1  (via drill 0.2)
  Top 0.203: J11.2 J1.P0.05 | J13.2 35.83,10.16 47.62,10.16 52.7,15.24 v52.7,16.51
  Bottom 0.203: v52.7,16.51 52.7,29.84 J1.P0.05
LCD_MISO
  Top 0.203: J9.6 J1.P0.16 50.8,68.58 50.8,70.64 J18.13
LCD_MOSI
  Top 0.203: J9.5 J1.P0.15 50.16,66.67 50.16,68.74 J18.14
LCD_SCLK
  Top 0.203: J9.7 J1.P0.17 51.44,70.48 51.44,72.55 J18.12
N$1
  Top 0.203: U2.24 28.64,73.46 28.02,74.09 C9.1
N$3
  Top 0.203: R4.2 24.05,109.6 18.67,109.6 17.35,110.92 15.98,110.92 14.66,109.6 D3.A
N$4
  Top 0.203: D4.A R3.2
N$5
  Top 0.203: D5.A R2.2
N$6
  Top 0.203: U2.21 29.93,73.8 C2.2
N$7  (via drill 0.2)
  Top 0.203: S1.1 17.78,43.82 v22.86,48.9 | v22.86,54.61 23.18,54.94 U1.2
  Bottom 0.203: v22.86,48.9 v22.86,54.61
N$18
  Top 0.406: R13.2 R8.2 22.66,97.94 C13.1 | J17.4 19.38,97.89 R6.2 21.28,97.92 C13.1 | C13.1 22.68,96.44 25.96,93.17 | 25.96,93.17 R7.2 | 25.96,93.17 26.04,93.09 U6.2 | U6.1 26.98,92.78 26.59,93.17 25.96,93.17
N$25
  Top 0.203: D2.A R1.2
N$50
  cutout Top: 62.23,104.14 50.8,104.14 50.8,114.3 62.23,114.3
N$51
  cutout Bottom: 62.23,104.14 50.8,104.14 50.8,114.3 62.23,114.3
SD_ENABLE  (via drill 0.2)
  Top 0.203: J7.2 J1.P0.26 55.24,92.33 38.99,92.33 v36.2,89.53 | U6.3 25.09,91.25 25.53,90.8 R14.1 29.41,89.97 29.84,89.53 v30.48,89.53
  Bottom 0.203: v30.48,89.53 v36.2,89.53
SD_MISO
  Top 0.203: J9.2 J1.P0.12 52.7,56.52 52.7,57.79 50.16,60.33 24.13,60.33 18.41,66.04 18.41,76.83 12.7,82.55 12.7,99.06 14.83,101.19 J17.7 19.4,101.19 19.81,101.6 R8.1
SD_MOSI  (via drill 0.2)
  Top 0.203: J9.1 J1.P0.11 51.44,55.25 51.44,57.15 48.9,59.69 v26.04,59.69 | R6.1 18.72,96.09 18.03,96.77 16.43,96.77 J17.3 14.88,96.79 13.97,95.88 13.97,83.82 19.68,78.1 19.68,67.31 25.4,61.59 v26.04,61.59
  Bottom 0.203: v26.04,61.59 v26.04,59.69
SD_SCLK
  Top 0.203: J9.3 J1.P0.13 53.98,57.79 50.8,60.96 24.77,60.96 19.05,66.67 19.05,77.47 13.34,83.18 13.34,98.42 13.9,98.99 J17.5
SENSORS_SCL  (via drill 0.2)
  Top 0.203: J7.10 J1.P0.19 53.98,72.64 49.53,77.09 35.81,77.09 | U3.3 60.71,109.85 v60.71,107.19 60.71,102.55 | U5.6 56.12,112 v56.13,112.01 | J14.1 40.64,16.05 v40.64,58.42 | R10.1 55.8,97.79 | U2.2 27.8,72.27 27.18,72.9 27.18,75.18 29.08,77.09 35.31,77.09 | v40.64,67.56 40.64,72.26 35.81,77.09 | 35.31,77.09 35.81,77.09 | 35.31,77.09 35.31,92.71 37.47,94.87 52.53,94.87 55.45,97.79 55.8,97.79 | U4.4 60.71,102.55 | 55.8,97.79 58.42,97.79 60.71,100.08 60.71,102.55
  Bottom 0.203: v40.64,58.42 v40.64,67.56 | v56.13,112.01 57.66,110.49 57.66,107.7 58.17,107.19 v60.71,107.19
SENSORS_SDA  (via drill 0.2)
  Top 0.203: J1.P0.20 J7.9 | U3.2 58.67,109.85 58.67,108.2 v59.18,108.2 59.18,105.92 57.52,104.25 U4.6 54.92,102.55 52.91,100.53 R11.1 51.89,97.54 36.58,97.54 33.66,94.61 v33.66,78.74 | U5.1 53.3,113.03 v56.13,113.03 | J14.2 41.91,16.78 v41.91,58.42 | U2.4 27.73,71.41 27.18,70.87 27.18,69.6 27.94,68.83 v29.46,68.83 | v41.91,64.77 38.86,64.77 v36.07,67.56
  Bottom 0.203: v41.91,58.42 v41.91,64.77 41.91,69.6 46.74,74.42 55.12,74.42 J1.P0.20 | v56.13,113.03 59.18,109.98 v59.18,108.2 | v29.46,68.83 30.73,68.83 32.77,70.87 | 32.77,70.87 33.66,71.75 v33.66,78.74 | 32.77,70.87 v36.07,67.56
SWITCH_0  (via drill 0.2)
  Top 0.203: J7.8 J1.P0.22 | S4.IN 11.43,20.32 v11.43,22.23 | v16.51,22.23 19.05,24.77 19.05,38.73 v17.78,40.01 | v22.23,67.94 22.23,83.18 23.62,84.58 v30.48,84.58
  Bottom 0.203: v11.43,22.23 v16.51,22.23 | v17.78,40.01 17.78,63.5 v22.23,67.94 | J1.P0.22 49.02,84.58 37.34,84.58 v30.48,84.58
UART_RX
  Top 0.203: J11.5 J1.P0.08 49.53,34.29 49.53,21.86 J15.2 49.01,8.64 47.15,8.64 J16.2
UART_TX
  Top 0.203: J11.3 J1.P0.06 50.93,30.61 50.93,22.73 52.2,21.46 56.01,21.46 57.78,19.69 57.78,15.41 J15.1 49.48,7.11 J16.1

### Text on the board
tPlace: RESET | POWER | MS5637 / PRESS | SI7021 / TEMP & / HUMID | OPT3004 / LIGHT | !LIGHT_INT | SD_EN | GROVE_D0 | SD Card | !LED_0 | !LED_1 | !LED_2 | SWITCH_0 | LSM9DS1TR / I2C ACCELEROMETER / GYRO & MAGNETOMETER | SDA | +X | SCL | +Z | . | !LCD_CS | LCD_SCLK | GND | +Y | LCD_MISO | GROVE_A1 | LCD_MOSI | GROVE_A0 | ADXL327 / ANALOG ACCELEROMETER | !SD_CS | !BUTTON_0 | ACCEL_X | SD_SCLK | +Y | SD_MISO | ACCEL_Y | +Z | . | ACCEL_Z | SD_MOSI | ACCEL / SELF TEST | +X | GND | GND | 0 | 1 | 2 | !IMU_INT | GROVE_D1 | Berkeley Buckler | C | B. Ghena, N. Jackson | BUTTON_0 | July 2020 | GND | GND | GND | GND | VCC | VCC | VCC | VCC | A1 | D1 | SDA | RX | A0 | D0 | SCL | TX | SWITCH_0 | GND | GND
tNames: SD_DETECT | J2 | J1 | J4 | J3 | J5 | LO | HI